# EAGLE design headphone-driver (EAGLE 9.5.1)
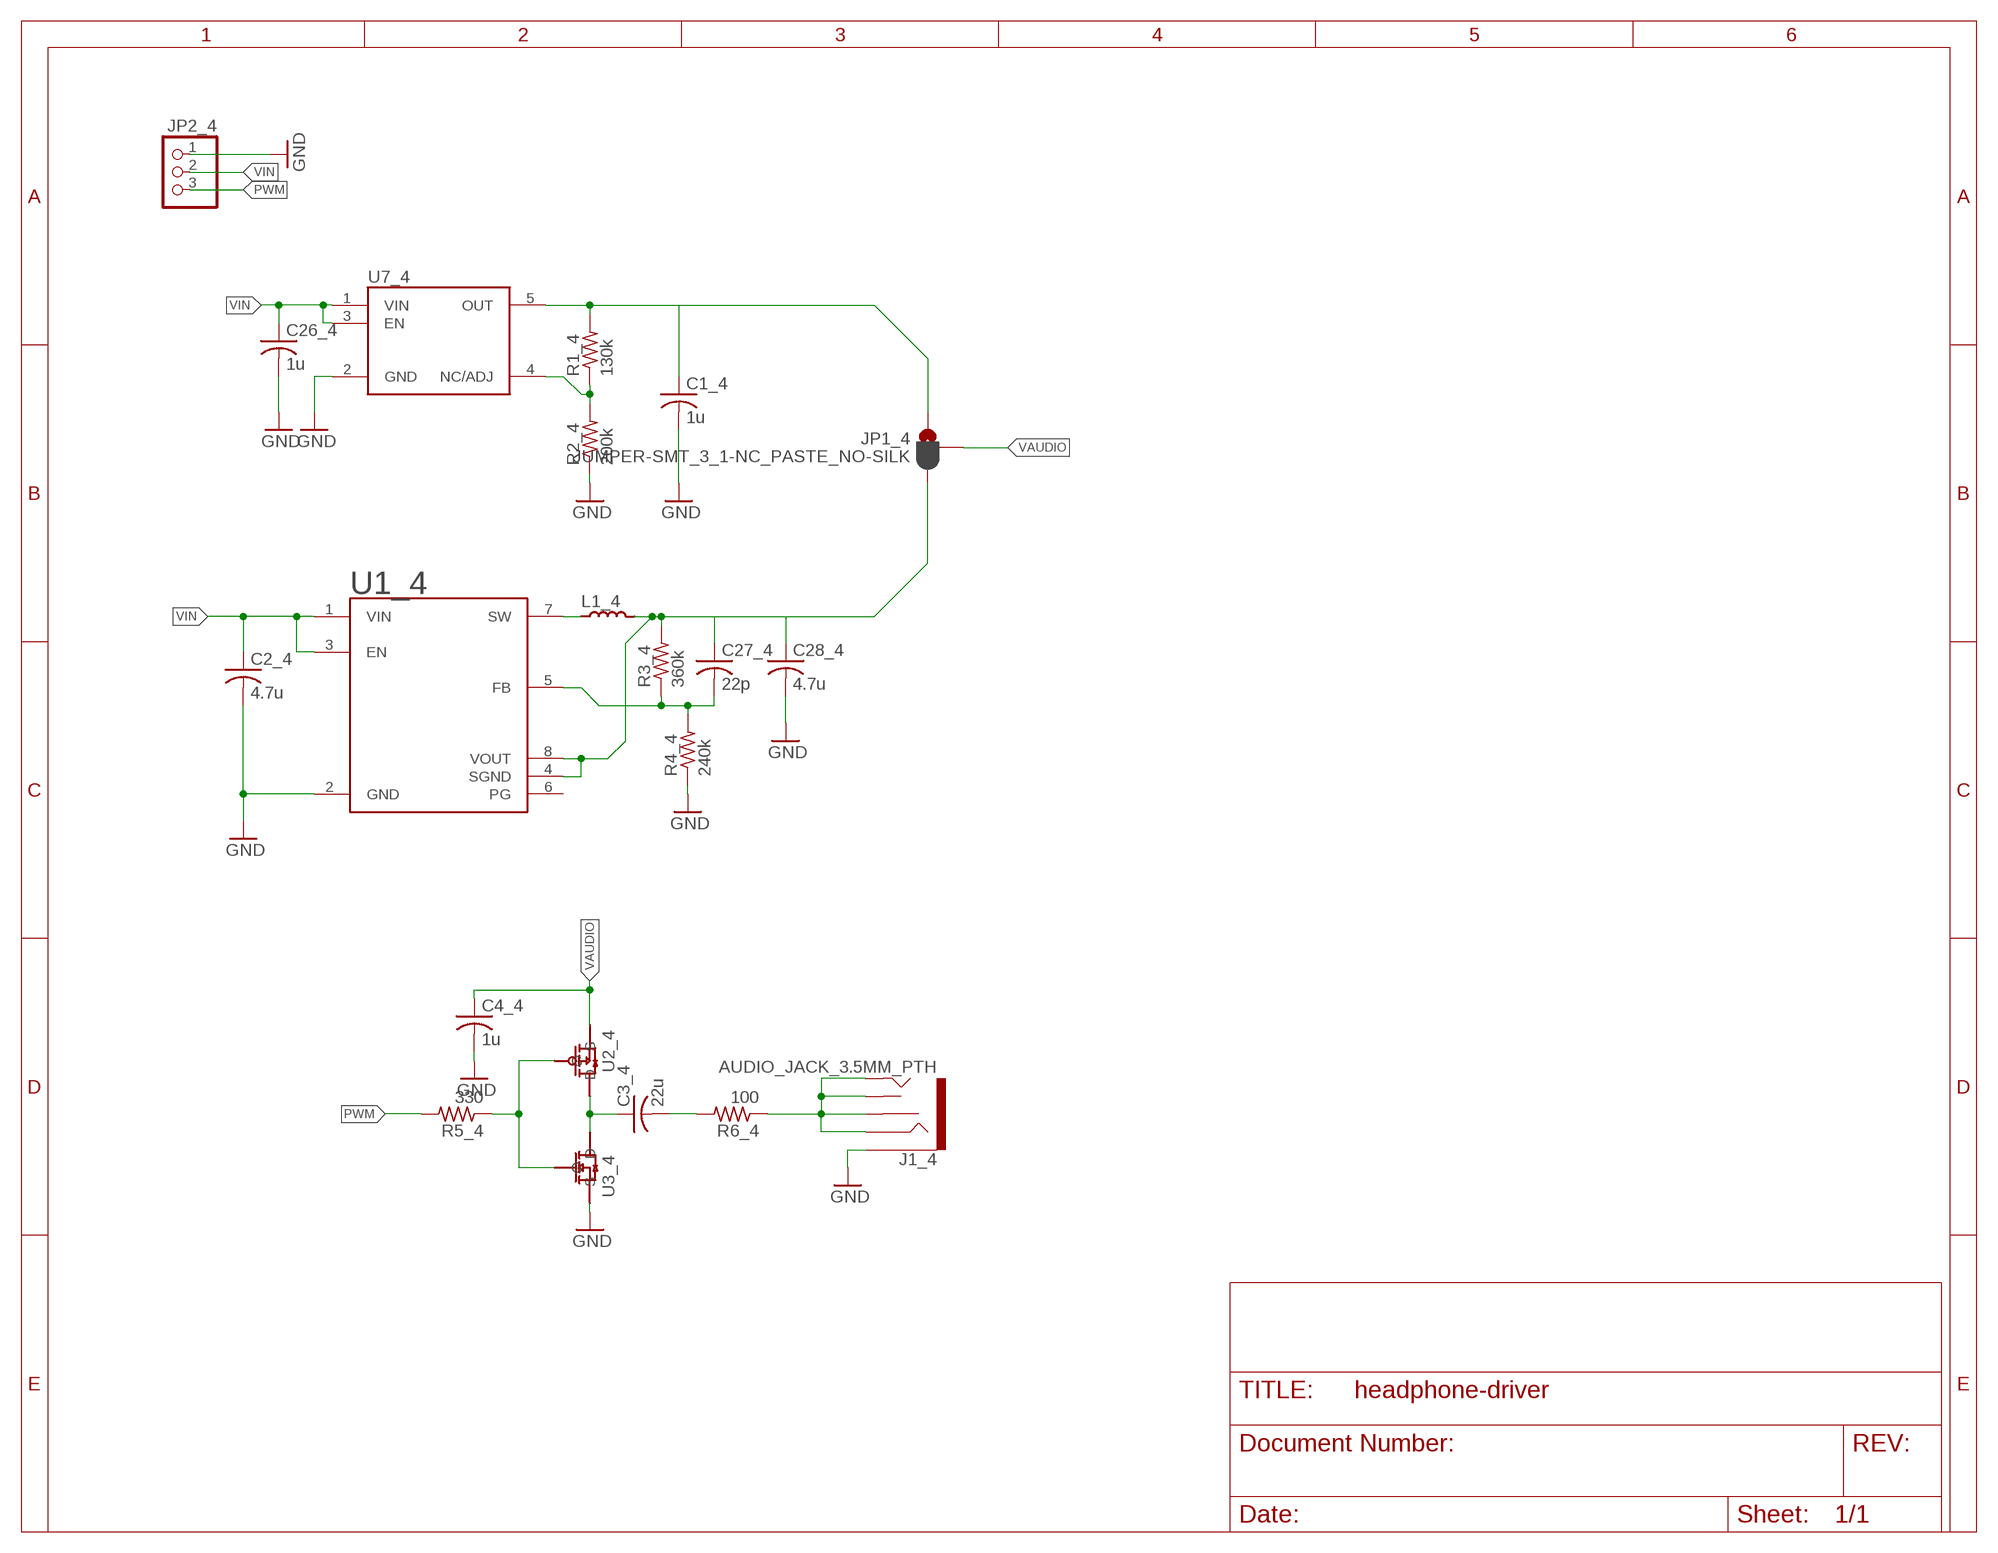
[diagram p0: schematic, sheet 1]

## Parts
C1_4  1u  C-USC0603  [C0603]
C2_4  4.7u  C-USC0603  [C0603]
C3_4  22u  C-USC0805  [C0805]
C4_4  1u  C-USC0603  [C0603]
C26_4  1u  C-USC0603  [C0603]
C27_4  22p  C-USC0402  [C0402]
C28_4  4.7u  C-USC0603  [C0603]
J1_4  AUDIO_JACK_3.5MM_PTH  [AUDIO-JACK]
JP1_4  JUMPER-SMT_3_1-NC_PASTE_NO-SILK  [SMT-JUMPER_3_1-NC_PASTE_NO-SILK]
JP2_4  PINHD-1X3  [1X03]
L1_4  22u  LQH3NPN220MMEL  [LQH3NPNXXXXMEX]
R1_4  130k  R-US_R0603  [R0603]
R2_4  200k  R-US_R0603  [R0603]
R3_4  360k  R-US_R0603  [R0603]
R4_4  240k  R-US_R0603  [R0603]
R5_4  330  R-US_R0603  [R0603]
R6_4  100  R-US_R0603  [R0603]
U1_4  TPS62120  [SOP65P280X145-8N]
U2_4  TP2104K1-G  [TP2104K1-G]
U3_4  TN2106K1-G  [TN2106K1-G]
U7_4  MIC5225  [MIC5225]

## Nets
BUCK_OUT: C27_4.1 C28_4.1 JP1_4.3 L1_4.P$2 R3_4.2 U1_4.4(SGND) U1_4.8(VOUT)
GND: C1_4.2 C2_4.2 C4_4.2 C26_4.2 C28_4.2 J1_4.SLEEVE JP2_4.1 R2_4.1 R4_4.1 U1_4.2(GND) U3_4.S U7_4.2(GND)
LINEAR_OUT: C1_4.1 JP1_4.1 R1_4.2 U7_4.5(OUT)
N$1: R1_4.1 R2_4.2 U7_4.4(NC/ADJ)
N$2: R5_4.1 U2_4.G U3_4.G
N$3: C3_4.1 U2_4.D U3_4.D
N$4: C27_4.2 R3_4.1 R4_4.2 U1_4.5(FB)
N$5: L1_4.P$1 U1_4.7(SW)
N$6: C3_4.2 R6_4.2
N$9: J1_4.RING J1_4.RSH J1_4.TIP J1_4.TSH R6_4.1
PWM: JP2_4.3 R5_4.2
VAUDIO: C4_4.1 JP1_4.2 U2_4.S
VIN: C2_4.1 C26_4.1 JP2_4.2 U1_4.1(VIN) U1_4.3(EN) U7_4.1(VIN) U7_4.3(EN)
Unconnected: U1_4.6(PG)

## Library data of the parts
C1_4 C4_4 C26_4 = rcl:C-US: CAPACITOR, American symbol; MFR: SAMSUNG; MFR_PN: CL10B105KA8NNNC; SPICEPREFIX: C
C2_4 C28_4 = rcl:C-US: CAPACITOR, American symbol; MFR: SAMSUNG; MFR_PN: CL10A475KA8NQNC; SPICEPREFIX: C
C3_4 = rcl:C-US: CAPACITOR, American symbol; MFR: MURATA; MFR_PN: GRM21BR61E226ME44L; SPICEPREFIX: C
C27_4 = rcl:C-US: CAPACITOR, American symbol; MFR: KEMET; MFR_PN: C0603C220J5GACTU; SPICEPREFIX: C
J1_4 = SparkFun-Connectors:AUDIO_JACK_3.5MM: Audio Jack 3.5mm variants of PTH and SMT stereo audio jack with bypass switches. SparkFun Products: SparkFun SparkPunk Sound Kit <[https://www.sparkfun.com/products/11177]> - PTH MP3 Trigger <https://www.sparkfun.com/products/13720> -3.5mm SMD SparkFun PicoBoard <https://www.sparkfun.com/products/11888>- 2.5mm SMD; PROD_ID: CONN-08774; SF_ID: PRT-08032
JP1_4 = SparkFun-Jumpers:JUMPER-SMT_3_1-NC_PASTE: Normally closed solder jumper (1 of 2 connections) This jumper has an aperture in the stencil to allow solder paste to bridge one of the two connections. One connection is normally closed (NC), while the other is normally open (NO). Wick off the solder to open the connection. Reapply solder to reclose the connection. Apply solder to the other side instead to change the current path.
JP2_4 = pinhead:PINHD-1X3: PIN HEADER
L1_4 = afig-0007:LQH3NPN220MMEL; MFR: MURATA; MFR_PN: LQH3NPN220MJRL
R1_4 = rcl:R-US_: RESISTOR, American symbol; MFR: PANASONIC; MFR_PN: ERJ-3GEYJ134V; SPICEPREFIX: R
R2_4 = rcl:R-US_: RESISTOR, American symbol; MFR: PANASONIC; MFR_PN: ERJ-3GEYJ204V; SPICEPREFIX: R
R3_4 = rcl:R-US_: RESISTOR, American symbol; MFR: PANASONIC; MFR_PN: ERJ-3GEYJ364V; SPICEPREFIX: R
R4_4 = rcl:R-US_: RESISTOR, American symbol; MFR: PANASONIC; MFR_PN: ERJ-3GEYJ244V; SPICEPREFIX: R
R5_4 = rcl:R-US_: RESISTOR, American symbol; MFR: YAGEO; MFR_PN: RC0603FR-07330RL; SPICEPREFIX: R
R6_4 = rcl:R-US_: RESISTOR, American symbol; MFR: YAGEO; MFR_PN: RC0603JR-07100RL; SPICEPREFIX: R
U1_4 = afig-0007:TPS62120; MFR: TI; MFR_PN: TPS62120
U2_4 = tp2104:TP2104K1-G: P-Channel Enhancement-Mode Vertical DMOS FET; MFR: MICROCHIP; MFR_PN: TP2104K1-G
U3_4 = tn2106:TN2106K1-G: N-Channel Enhancement-Mode Vertical DMOS FET R_dson(max) = 2.5Ohm V_gs(th)(max) = 2V; MFR: MICROCHIP; MFR_PN: TN2106K1-G
U7_4 = afig-0007:MIC5225; MFR: MICROCHIP; MFR_PN: MIC5225YM5

## Board
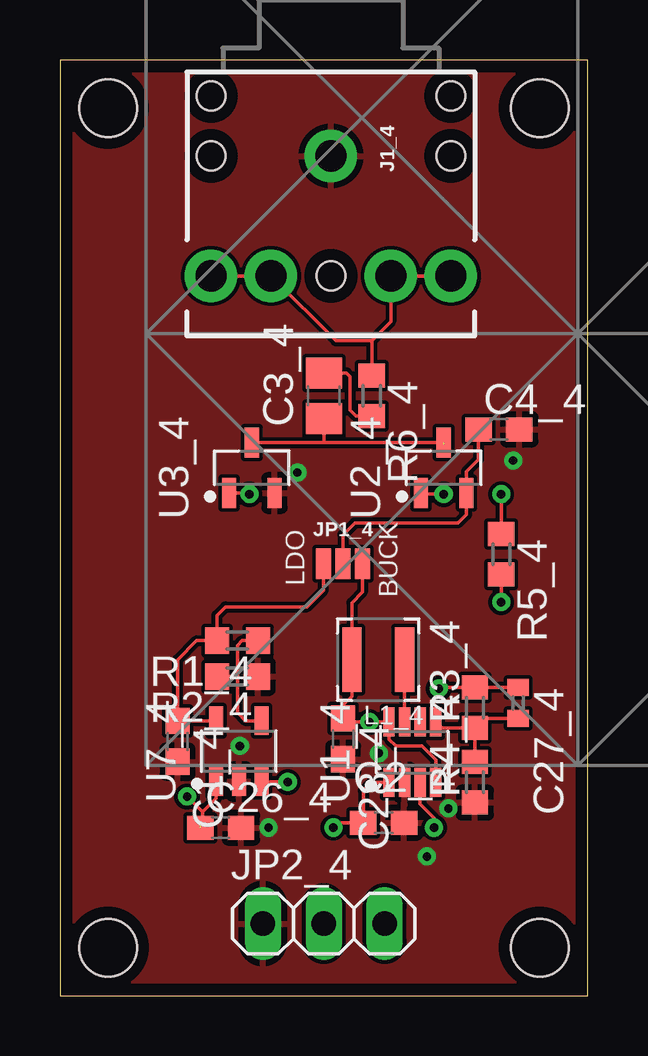
[diagram p1: board, top side]
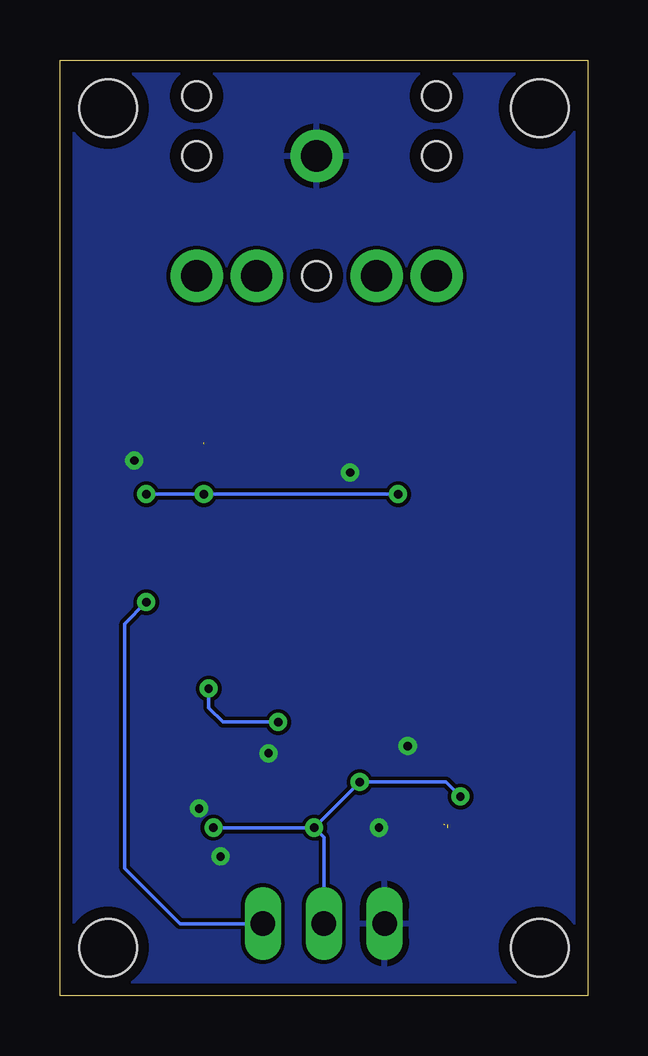
[diagram p2: board, bottom side, seen from below]

Size 22 x 39 mm. Coordinates in mm from the lower left corner, seen from the top.
Outline: 0,0 22,0 22,39 0,39 0,0
Copper layers (1*16): Top 0.035mm / dielectric 1.5mm / Bottom 0.035mm
Design rules "default *": minimum track width 6mil, minimum drill 0.35mm, track to track 6mil, track to pad 6mil, pad to pad 6mil, via to via 6mil, smd to smd 6mil, copper to edge 20mil, drill to drill 6mil, minimum pad ring 10mil, minimum via ring 8mil, stop-mask expansion 4mil, vias tented up to drill 15mil, thermal gap 10mil
Holes 2.4 mm at 20,2 2,2 2,37 20,37

### Footprints (pad centres in the part's own frame; a part is rotated, then mirrored left to right if it is on the bottom)
C0603 = smd 1.1 x 1: 1 -0.85,0; 2 0.85,0
C0805 = smd 1.3 x 1.5: 1 -0.95,0; 2 0.95,0
C0402 = smd 0.7 x 0.9: 1 -0.65,0; 2 0.65,0
AUDIO-JACK = drill 1.3 pad 2.184: RING 5,5; RSH 5,2.5; SLEEVE 0,0; TIP 5,-5; TSH 5,-2.5 | hole 1.2: 0,5; -2.5,5; -2.5,-5; 0,-5; 5,0
SMT-JUMPER_3_1-NC_PASTE_NO-SILK = smd 0.635 x 1.27: 1 -0.813,0; 2 0,0; 3 0.813,0
1X03 = drill 1.016 long: 1 -2.54,0; 2 0,0; 3 2.54,0
LQH3NPNXXXXMEX = smd 0.8 x 2.7: P$1 -1.1,0; P$2 1.1,0
R0603 = smd 1 x 1.1: 1 -0.85,0; 2 0.85,0
SOP65P280X145-8N = smd 1.209 x 0.475: 1 -1.253,0.975; 2 -1.253,0.325; 3 -1.253,-0.325; 4 -1.253,-0.975; 5 1.253,-0.975; 6 1.253,-0.325; 7 1.253,0.325; 8 1.253,0.975
TP2104K1-G = smd 1.24 x 0.589: D 1.056,0; G -1.056,0.95; S -1.056,-0.95
TN2106K1-G = smd 1.24 x 0.589: D 1.056,0; G -1.056,0.95; S -1.056,-0.95
MIC5225 = smd 1.186 x 0.584: 1 -1.264,0.95; 2 -1.264,0; 3 -1.264,-0.95; 4 1.264,-0.95; 5 1.264,0.95

### Placement (x,y rotation side)
C1_4  4.9,10.6 270 top
C2_4  13.5,7.2 0 top
C3_4  11,25 90 top
C4_4  18.3,23.6 0 top
C26_4  6.7,7 0 top
C27_4  19.1,12.2 270 top
C28_4  11.81,10.7 270 top
J1_4  11.3,35 270 top
JP1_4  11.8,18 0 top
JP2_4  11,3 0 top
L1_4  13.27,14 180 top
R1_4  7.4,14.8 180 top
R2_4  7.4,13.3 180 top
R3_4  17.3,12 90 top
R4_4  17.3,8.9 90 top
R5_4  18.4,18.4 270 top
R6_4  13,25 270 top
U1_4  14.7,10.14 90 top
U2_4  16,22 90 top
U3_4  8,22 90 top
U7_4  7.46,10.19 90 top

### Tracks (layer width: path | path; a pad name or v marks a point on that pad's centre or on a via)
BUCK_OUT  (via drill 0.35)
  Top 0.152: U1_4.4 15.67,9.83 15.1,10.4 14,10.4 13.72,10.68 U1_4.8 v12.9,11.4 | C27_4.1 R3_4.2 15.85,12.85 v15.8,12.8 | JP1_4.3 12.61,16.81 12.17,16.37 L1_4.P$2 12.17,12.47 11.81,12.11 C28_4.1 11.96,11.4 v12.9,11.4 | v12.9,11.4
  Bottom 0.152: v15.8,12.8 15.8,12 15.2,11.4 v12.9,11.4
GND  (via drill 0.35)
  other vias: 8.7,7 7.5,10.4 13.3,10.1 15.3,5.8 16.2,7.8 18.9,22.3 9.9,21.8
  pour Top: 0,-2 23.65,-2 23.65,40.25 0,40.25
  pour Bottom: 0,-3 23.92,-3 23.92,40.25 0,40.25
LINEAR_OUT
  Top 0.152: U7_4.5 C1_4.1 4.9,14 5.7,14.8 R1_4.2 6.55,15.85 6.9,16.2 10.3,16.2 10.99,16.89 JP1_4.1
N$1
  Top 0.152: R1_4.1 7.6,14.8 7.4,14.6 7.4,13.3 | U7_4.4 7.75,11.45 7.4,11.8 7.4,13.3 | R2_4.2 7.4,13.3
N$2  (via drill 0.35)
  Top 0.152: U3_4.G 7.86,20.94 v7.9,20.9 | v16,20.9 15.09,20.9 U2_4.G | R5_4.1 v18.4,20.9
  Bottom 0.152: v7.9,20.9 v16,20.9 v18.4,20.9
N$3  (1 unrouted)
  Top 0.152: U3_4.D 11,23.06 | 11,23.06 15.94,23.06 16,23 | C3_4.1 11,23.06
N$4
  Top 0.152: R3_4.1 15.92,11.15 U1_4.5 | C27_4.2 17.7,11.55 R3_4.1 | R4_4.2 R3_4.1
N$5
  Top 0.152: L1_4.P$1 U1_4.7
N$6
  Top 0.152: C3_4.2 11.95,25.95 12.1,25.8 12.1,24.4 12.35,24.15 R6_4.2
N$9
  Top 0.152: R6_4.1 13,27.3 | 13,27.3 13.8,28.1 J1_4.RSH J1_4.RING | J1_4.TIP J1_4.TSH 11.5,27.3 13,27.3
PWM  (via drill 0.35)
  Top 0.152: R5_4.2 v18.4,16.4
  Bottom 0.152: v18.4,16.4 19.3,15.5 19.3,5.3 17,3 JP2_4.3
VAUDIO
  Top 0.152: JP1_4.2 11.8,19.2 12.3,19.7 16.6,19.7 16.95,20.05 U2_4.S 16.95,21.85 17.45,22.35 C4_4.1
VIN  (via drill 0.35)  (2 unrouted)
  Top 0.152: U7_4.1 6.51,8.21 5.95,7.65 | 5.95,7.65 5.95,7.1 | U1_4.1 12.99,8.89 12.65,8.55 C2_4.1 11.6,7.2 v11.4,7 | U1_4.3 15.02,7.98 15.6,7.4 v15.6,7 | v9.5,8.9 8.43,8.9 U7_4.3 | 6,7.13 5.85,7.13 | v5.3,8.3 5.95,7.65
  Bottom 0.152: v15.6,7 v11.4,7 | v11.4,7 v9.5,8.9 5.9,8.9 v5.3,8.3 | v11.4,7 11,6.6 JP2_4.2

### Text on the board
tPlace: LDO | BUCK
tDocu: optional / power reg